# Altium project 230223_PIFProject_ProjectCuoiKhoa_Tvy.PrjPcb
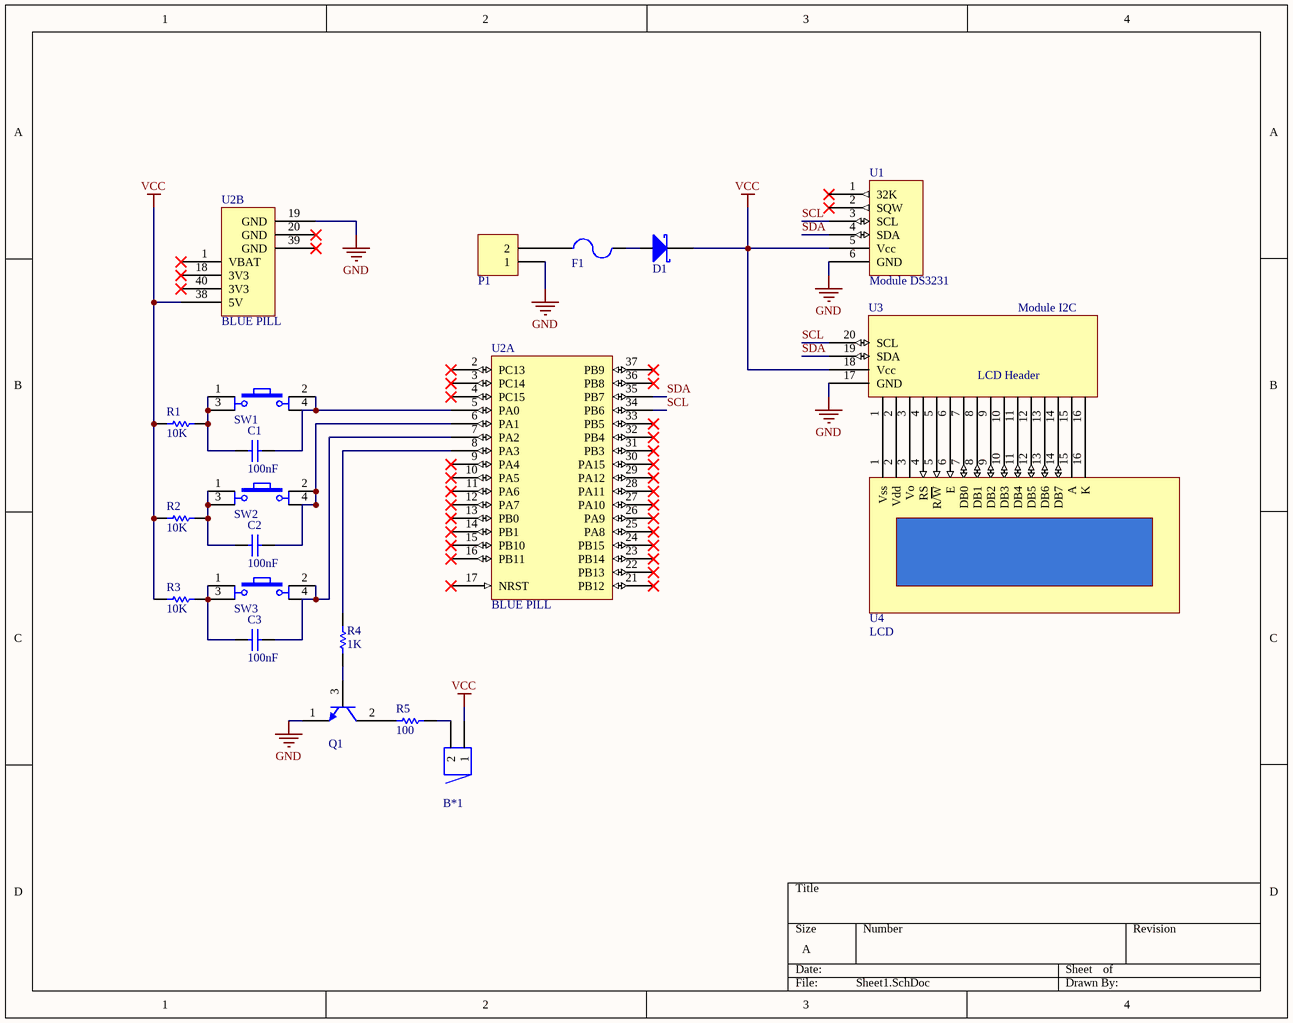
[diagram p0: Sheet1.SchDoc]
1 sheet, 20 parts. Net scope: global (net labels, ports and power ports of the same name join across sheets).
Board files: PCB1.PcbDoc, PCB2.PcbDoc

## Sheet Sheet1.SchDoc
size A; SheetNumber: 1; SheetTotal: 1

### Parts
B*1  Buzzer  [BUZZER]  (value not drawn)
C1  value 100nF  [CAP-SM-0805]  (hidden comment: Cap Non-Pol SMD)
C2  value 100nF  [CAP-SM-0805]  (hidden comment: Cap Non-Pol SMD)
C3  value 100nF  [CAP-SM-0805]  (hidden comment: Cap Non-Pol SMD)
D1  D Schottky  [SS34]  (value not drawn)
F1  Fuse  [FUSE SMD]  (value not drawn)
P1  Domino 2  [DOMINO 2- 5mm]  (value not drawn)
Q1  C1815  [QTO-92]  (value not drawn)
R1  value 10K  [RES-SM-0805]  (hidden comment: RESISTOR SMD)
R2  value 10K  [RES-SM-0805]  (hidden comment: RESISTOR SMD)
R3  value 10K  [RES-SM-0805]  (hidden comment: RESISTOR SMD)
R4  value 1K  [RES-SM-0603]  (hidden comment: RESISTOR SMD)
R5  value 100  [RES-SM-0603]  (hidden comment: RESISTOR SMD)
SW1  SW  [Tact SW 4 pin]  (value not drawn)
SW2  SW  [Tact SW 4 pin]  (value not drawn)
SW3  SW  [Tact SW 4 pin]  (value not drawn)
U1  Module DS3231  [MODULE DS3231( Part B )]
U2  BLUE PILL  [STM32F103C8T6]  (parts A,B of 2)
U3  Module I2C  [Module I2C]
U4  LCD  [LCD1602]

### Nets
GND: P1.1 Q1.1(E) U1.6(GND) U2.19(GND) U3.17(GND)
VCC: B*1.1 D1.2(K) R1.1 R2.1 R3.1 U1.5(Vcc) U2.38(5V) U3.18(Vcc)
SCL: U1.3(SCL) U2.34(PB6) U3.20(SCL)
SDA: U1.4(SDA) U2.35(PB7) U3.19(SDA)
NetB*1_2: B*1.2 R5.2
NetC1_1: C1.1 R1.2 SW1.1 SW1.3
NetC1_2: C1.2 SW1.2 SW1.4 U2.5(PA0)
NetC2_1: C2.1 R2.2 SW2.1 SW2.3
NetC2_2: C2.2 SW2.2 SW2.4 U2.6(PA1)
NetC3_1: C3.1 R3.2 SW3.1 SW3.3
NetC3_2: C3.2 SW3.2 SW3.4 U2.7(PA2)
NetD1_1: D1.1(A) F1.2
NetF1_1: F1.1 P1.2
NetQ1_2: Q1.2(C) R5.1
NetQ1_3: Q1.3(B) R4.1
NetR4_2: R4.2 U2.8(PA3)
NetU3_1: U3.1(LCD_header_1) U4.1(Vss)
NetU3_2: U3.2(LCD_header_2) U4.2(Vdd)
NetU3_3: U3.3(LCD_header_3) U4.3(Vo)
NetU3_4: U3.4(LCD_header_4) U4.4(RS)
NetU3_5: U3.5(LCD_header_5) U4.5(R/W)
NetU3_6: U3.6 U4.6(E)
NetU3_7: U3.7(LCD_header_7) U4.7(DB0)
NetU3_8: U3.8(LCD_header_8) U4.8(DB1)
NetU3_9: U3.9(LCD_header_9) U4.9(DB2)
NetU3_10: U3.10(LCD_header_10) U4.10(DB3)
NetU3_11: U3.11(LCD_header_11) U4.11(DB4)
NetU3_12: U3.12(LCD_header_12) U4.12(DB5)
NetU3_13: U3.13(LCD_header_13) U4.13(DB6)
NetU3_14: U3.14(LCD_header_14) U4.14(DB7)
NetU3_15: U3.15(LCD_header_15) U4.15(A)
NetU3_16: U3.16(LCD_header_16) U4.16(K)

Not connected (* = marked no-connect by the designer): U1 1(32K)* 2(SQW)*; U2 1(VBAT)* 2(PC13)* 3(PC14)* 4(PC15)* 9(PA4)* 10(PA5)* 11(PA6)* 12(PA7)* 13(PB0)* 14(PB1)* 15(PB10)* 16(PB11)* 17(NRST)* 18(3V3)* 20(GND)* 21(PB12)* 22(PB13)* 23(PB14)* 24(PB15)* 25(PA8)* 26(PA9)* 27(PA10)* 28(PA11)* 29(PA12)* 30(PA15)* 31(PB3)* 32(PB4)* 33(PB5)* 36(PB8)* 37(PB9)* 39(GND)* 40(3V3)*

### Notes on the sheet
- (in symbol I2C interface for LCD) LCD Header

### Library data of the parts
C1-C3 = Cap Non-Pol SMD: Capacitor
D1 = D Schottky: Schottky Diode; Published: 8-Jun-2000; LatestRevisionDate: 17-Jul-2002; LatestRevisionNote: Re-released for DXP Platform.; PackageReference: SMB; Publisher: Altium Limited; PackageDescription: DO-214-AA/SMB; 2 C-Bend Leads; Body 5.3 x 3.6 mm, inc. leads (LxW); Code_JEDEC: DO-214-AA
P1 = Domino 2: Domino, 2-Pin; LatestRevisionDate: 17-Jul-2002; LatestRevisionNote: Re-released for DXP Platform.; Publisher: Altium Limited
Q1 = C1815: NPN Bipolar Transistor
R1-R5 = RESISTOR SMD: Resistor
SW1-SW3 = Tact SW - 4Pin: Switch button 4 pin; Value: Button chip 4 pin
U1 = DS3231: The  DS3231  is  a  low-cost,  extremely  accurate  I2C  real-time clock (RTC) with an integrated temperature-compensated  crystal  oscillator  (TCXO)  and  crystal.; Operating Voltage: 3V3 - 5V5; Manufacturer: N/A; Module Dimensions: 38 x 22 x 14 (LxWxH); Interface Type: I2C; ComponentLink1Description: Order link; ComponentLink1URL: https://www.thegioiic.com/ds3231-mach-thoi-gian-thuc-co-ic-nho-at24c32; ComponentLink2Description: Datasheet; ComponentLink2URL: https://pdf1.alldatasheet.com/datasheet-pdf/view/254832/MAXIM/DS3231.html
U2 = STM32F103C8T6: STM32F103C8T6, mbed-Enabled Development Bluepill STM32F1 ARM® Cortex®-M3 MCU 32-Bit Embedded Evaluation Board
U3 = I2C interface for LCD: I2C converter circuit for LCD; Manufacturer: Mantech; Operating Voltage: 2,5-6V; Default I2C Address: 0x27; Address selectable: 0x20-0x27; Module Dimensions: 41.5 x 19 x 15.3mm; Interface Type: I2C; ComponentLink1Description: Datasheet; ComponentLink1URL: http://www.mantech.co.za/datasheets/products/lcd2004-i2c.pdf; ComponentLink2Description: Oder link; ComponentLink2URL: https://www.thegioiic.com/mach-giao-tiep-lcd-ky-tu-1602-1604-2004-sang-i2c
U4 = LCD1602: LCD with 16x2 characters, black letters, yellow green background, with driver IC HD44780 Super Twisted Nematic (STN) LCD.; Manufacturer: 411 Technology systems; Viewing Area: 66.0 (W) x 16.0 (H) mm; Operating voltage: 3V3; Product Series: SSC2F16DLNW-S; Product category: LCD Character Display Modules & Accessories; Number of characters x lines: 16x2; Module Dimensions: 80.0 (W) x 36.0 (H) x 13.5 (D) mm; ComponentLink1Description: Datasheet; ComponentLink1URL: https://drive.google.com/file/d/0B5Gn6IGDpoOuS3VxMVRvc0hzb1U/view?resourcekey=0-ISqtCdex4nS5sK6QUoFO0A; ComponentLink2Description: Order link; ComponentLink2URL: https://www.thegioiic.com/lcd-1602-nen-vang-xanh-chu-den-3-3v; Series: SSC2F16DLNW-S